# EAGLE design MetaSenseV02.3 (EAGLE 7.5.0)
MetaSense AQI Sensing Platform (v2)
DESIGNER: Christine Chan
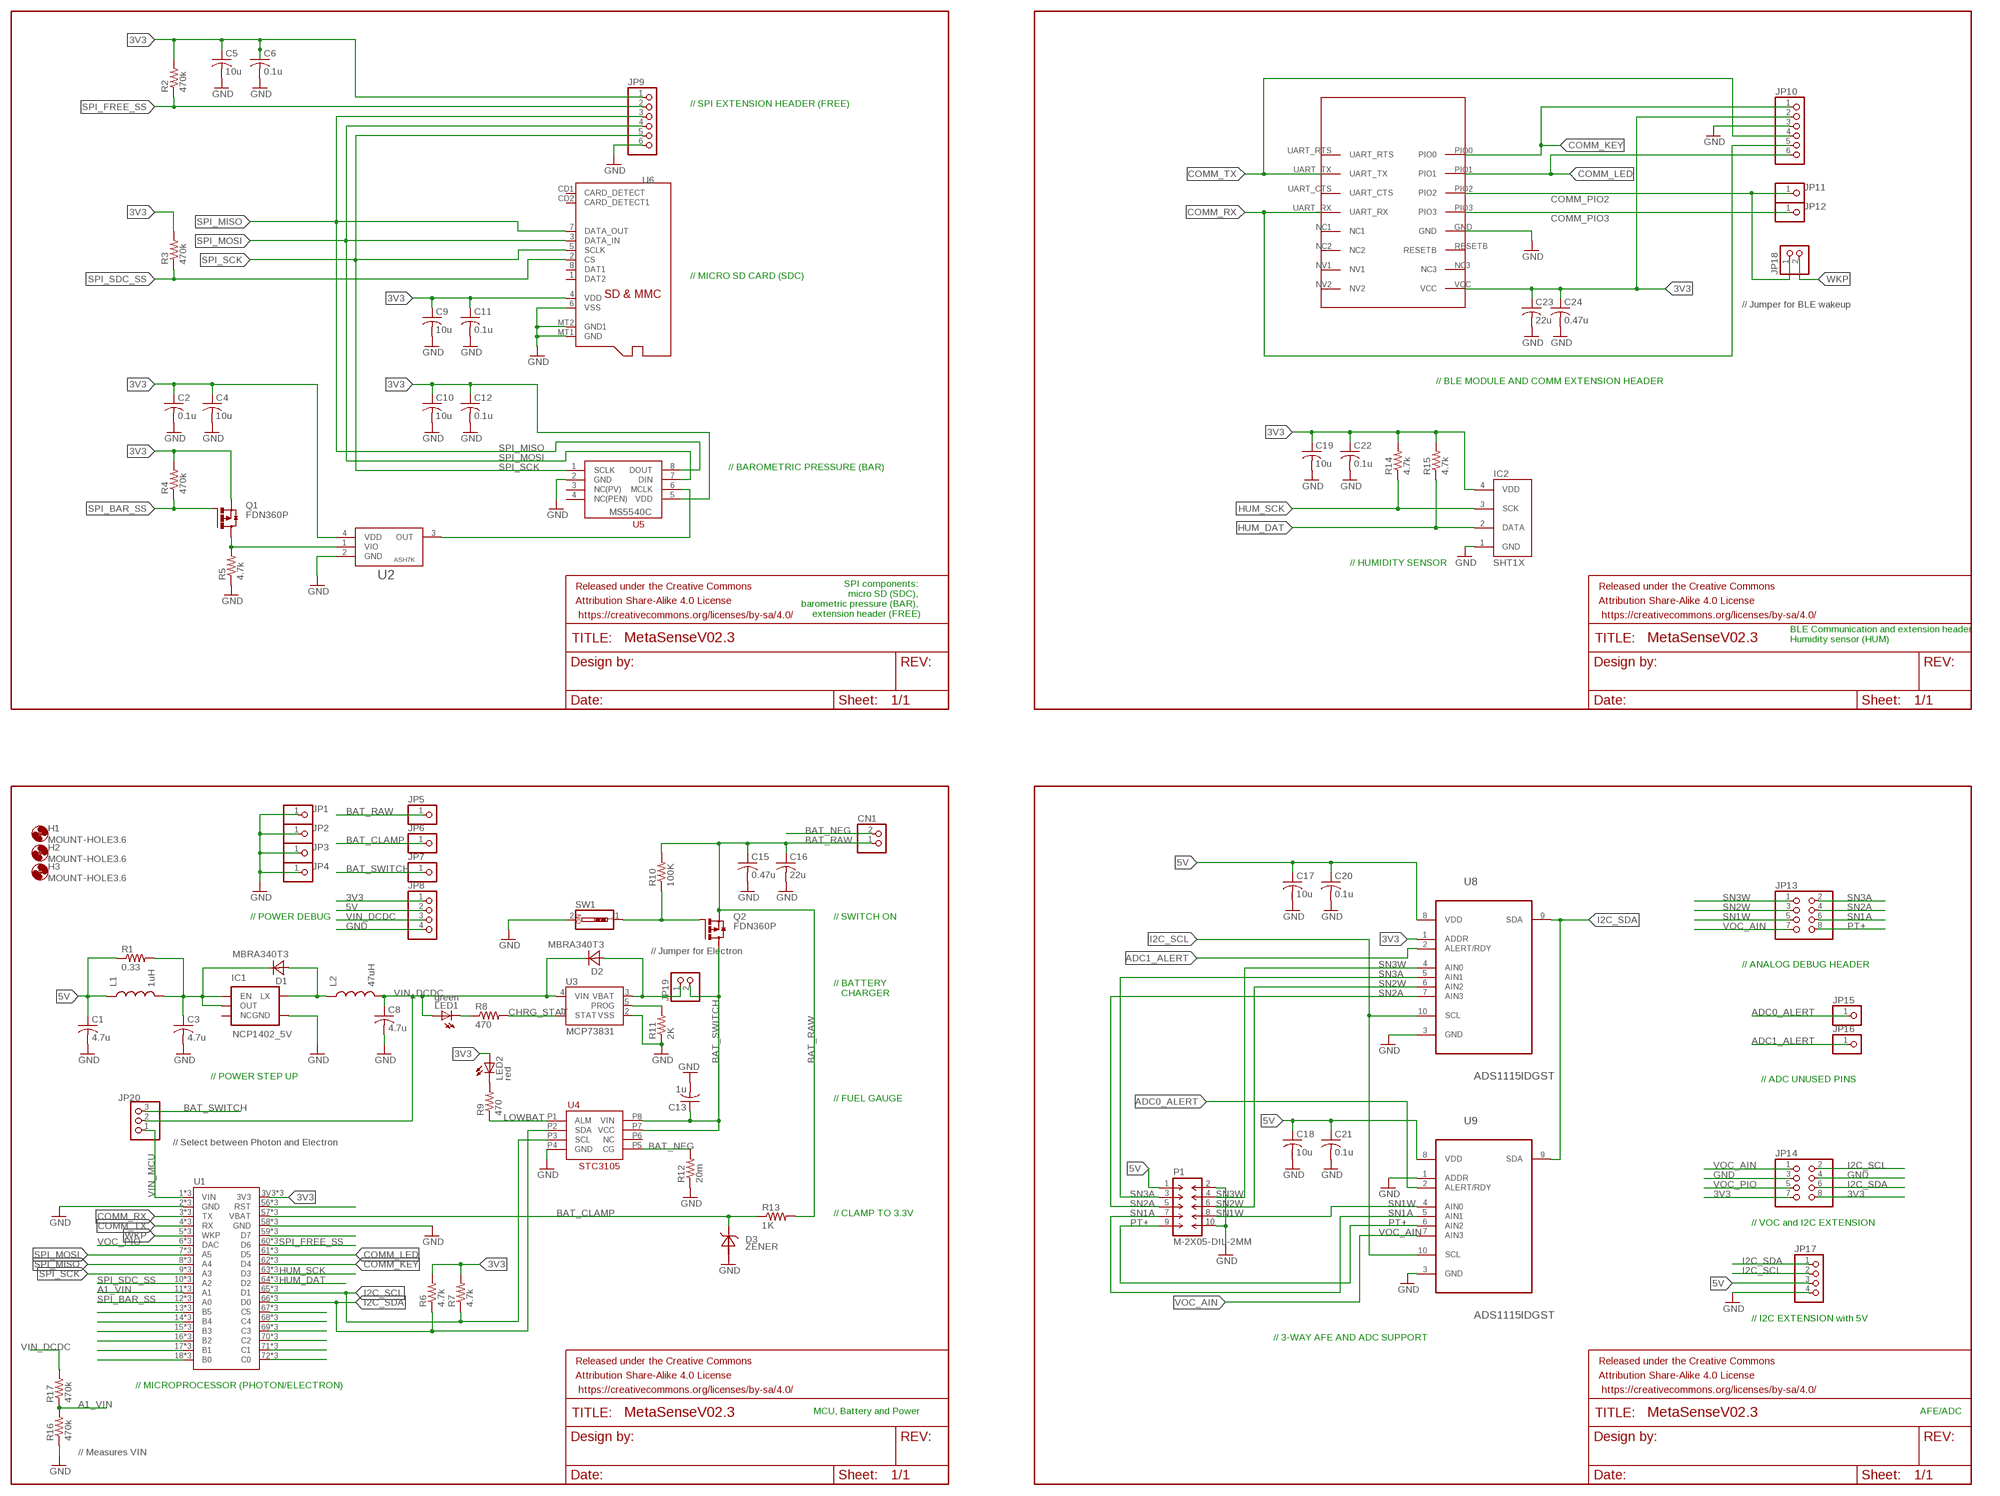
[diagram p0: schematic, sheet 1]

## Parts
C1  4.7u  C-USC0805  [C0805]
C2  0.1u  C-USC0805  [C0805]
C3  4.7u  C-USC0805  [C0805]
C4  10u  C-USC0805  [C0805]
C5  10u  C-USC0805  [C0805]
C6  0.1u  C-USC0805  [C0805]
C8  4.7u  C-USC0805  [C0805]
C9  10u  C-USC0805  [C0805]
C10  10u  C-USC0805  [C0805]
C11  0.1u  C-USC0805  [C0805]
C12  0.1u  C-USC0805  [C0805]
C13  1u  C-USC0805  [C0805]
C15  0.47u  C-USC0805  [C0805]
C16  22u  C-USC0805  [C0805]
C17  10u  C-USC0805  [C0805]
C18  10u  C-USC0805  [C0805]
C19  10u  C-USC0805  [C0805]
C20  0.1u  C-USC0805  [C0805]
C21  0.1u  C-USC0805  [C0805]
C22  0.1u  C-USC0805  [C0805]
C23  22u  C-USC0805  [C0805]
C24  0.47u  C-USC0805  [C0805]
CN1  JST_2PIN-THM  [JST-PH-2-THM]
D1  MBRA340T3  [SMA]
D2  MBRA340T3  [SMA]
D3  ZENER  [SOD-123_MINI-SMA]
FRAME1  FRAME-LETTERNO_PACKAGE  [DUMMY]
FRAME2  FRAME-LETTERNO_PACKAGE  [DUMMY]
FRAME3  FRAME-LETTERNO_PACKAGE  [DUMMY]
FRAME4  FRAME-LETTERNO_PACKAGE  [DUMMY]
H1  MOUNT-HOLE3.6  [3,6]
H2  MOUNT-HOLE3.6  [3,6]
H3  MOUNT-HOLE3.6  [3,6]
IC1  NCP1402_5V  V_REG_NCP1400_5V  [SOT23-5]
IC2  SHT1X  [SHT1X]
JP1  PINHD-1X1  [1X01]
JP2  PINHD-1X1  [1X01]
JP3  PINHD-1X1  [1X01]
JP4  PINHD-1X1  [1X01]
JP5  PINHD-1X1  [1X01]
JP6  PINHD-1X1  [1X01]
JP7  PINHD-1X1  [1X01]
JP8  PINHD-1X4  [1X04]
JP9  PINHD-1X6  [1X06]
JP10  PINHD-1X6  [1X06]
JP11  PINHD-1X1  [1X01]
JP12  PINHD-1X1  [1X01]
JP13  PINHD-2X4  [2X04]
JP14  PINHD-2X4  [2X04]
JP15  PINHD-1X1  [1X01]
JP16  PINHD-1X1  [1X01]
JP17  PINHD-1X4  [1X04]
JP18  PINHD-1X2  [1X02]
JP19  PINHD-1X2  [1X02]
JP20  PINHD-1X3  [1X03]
L1  1uH  INDUCTOR0805  [0805]
L2  47uH  INDUCTOR0805  [0805]
LED1  green  LEDCHIPLED_0805  [CHIPLED_0805]
LED2  red  LEDCHIPLED_0805  [CHIPLED_0805]
P1  M-2X05-DIL-2MM  [DIL-2MM-2X05]
Q1  FDN360P  [SUPER-SOT3]
Q2  FDN360P  [SUPER-SOT3]
R1  0.33  R-US_R0805  [R0805]
R2  470k  R-US_R0805  [R0805]
R3  470k  R-US_R0805  [R0805]
R4  470k  R-US_R0805  [R0805]
R5  4.7k  R-US_R0805  [R0805]
R6  4.7k  R-US_R0805  [R0805]
R7  4.7k  R-US_R0805  [R0805]
R8  470  R-US_R0805  [R0805]
R9  470  R-US_R0805  [R0805]
R10  100K  R-US_R0805  [R0805]
R11  2K  R-US_R0805  [R0805]
R12  20m  R-US_R0805  [R0805]
R13  1K  R-US_R0805  [R0805]
R14  4.7k  R-US_R0805  [R0805]
R15  4.7k  R-US_R0805  [R0805]
R16  470k  R-US_R0805  [R0805]
R17  470k  R-US_R0805  [R0805]
SW1  SW_DIP-1  [EDG-01]
U1  ELECTRONDUALROW  [ELECTRON_DUAL-ROW]
U2  ASH7K-OSCILLATOR  [SMD-4PAD]
U3  MCP73831  [SOT23-5]
U4  STC3105  [TDFN-8-3X2MM]
U5  MS5540CSMD  [SMD-HYBRID]
U6  MICROSD  [MICROSD]
U7  HM-11  [HM-11]
U8  ADS1115IDGST  [SOP50P490X110-10N]
U9  ADS1115IDGST  [SOP50P490X110-10N]

## Nets
3V3: C2.1 C4.1 C5.1 C6.1 C9.1 C10.1 C11.1 C12.1 C19.1 C22.1 C23.1 C24.1 IC2.4(VDD) JP8.1 JP9.1 JP10.2 JP14.7 JP14.8 LED2.A Q1.2(S) R2.2 R3.2 R4.2 R6.2 R7.2 R14.2 R15.2 U1.3V3 U1.55(3V3) U1.91(3V3) U2.4(VDD) U5.5(VDD) U6.4(VDD) U7.VCC U8.1(ADDR)
5V: C1.1 C17.1 C18.1 C20.1 C21.1 JP8.2 JP17.3 L1.1 P1.1 R1.1 U8.8(VDD) U9.8(VDD)
A1_VIN: R16.2 R17.1 U1.11(A1) U1.47(A1) U1.A1
ADC0_ALERT: JP15.1 U9.2(ALERT/RDY)
ADC1_ALERT: JP16.1 U8.2(ALERT/RDY)
BAT_CLAMP: D3.C(CAT) JP6.1 R13.1 U1.57(VBAT) U1.93(VBAT) U1.VBAT
BAT_NEG: CN1.2 R12.2 U4.P5(CG)
BAT_RAW: C15.1 C16.1 CN1.1 JP5.1 Q2.2(S) R10.2 R13.2
BAT_SWITCH: C13.1 JP7.1 JP19.2 JP20.3 Q2.3(D) U4.P7(VCC) U4.P8(VIN)
CHRG_STAT: R8.2 U3.1(STAT)
COMM_KEY: JP10.1 U1.62(D4) U1.98(D4) U1.D4 U7.PIO0
COMM_LED: JP10.6 U1.61(D5) U1.97(D5) U1.D5 U7.PIO1
COMM_PIO2: JP11.1 JP18.1 U7.PIO2
COMM_PIO3: JP12.1 U7.PIO3
COMM_RX: JP10.5 U1.3(TX) U1.39(TX) U1.TX U7.UART_RX
COMM_TX: JP10.4 U1.4(RX) U1.40(RX) U1.RX U7.UART_TX
GND: C1.2 C2.2 C3.2 C4.2 C5.2 C6.2 C8.2 C9.2 C10.2 C11.2 C12.2 C13.2 C15.2 C16.2 C17.2 C18.2 C19.2 C20.2 C21.2 C22.2 C23.2 C24.2 D3.A(AN) IC1.4(GND) IC2.1(GND) JP1.1 JP2.1 JP3.1 JP4.1 JP8.4 JP9.6 JP10.3 JP14.3 JP14.4 JP17.4 P1.2 P1.10 R5.1 R11.1 R12.1 R16.1 SW1.2 U1.2(GND) U1.38(GND) U1.58(GND) U1.94(GND) U1.GND U1.GND@2(GND) U2.2(GND) U3.2(VSS) U4.P4(GND) U5.2(GND) U6.6(VSS) U6.MT1(GND) U6.MT2(GND1) U7.GND U8.3(GND) U9.1(ADDR) U9.3(GND)
HUM_DAT: IC2.2(DATA) R15.1 U1.64(D2) U1.100(D2) U1.D2
HUM_SCK: IC2.3(SCK) R14.1 U1.63(D3) U1.99(D3) U1.D3
I2C_SCL: JP14.2 JP17.2 R7.1 U1.65(D1) U1.101(D1) U1.D1 U4.P3(SCL) U8.10(SCL) U9.10(SCL)
I2C_SDA: JP14.6 JP17.1 R6.1 U1.66(D0) U1.102(D0) U1.D0 U4.P2(SDA) U8.9(SDA) U9.9(SDA)
LOWBAT: R9.1 U4.P1(ALM)
N$1: Q1.3(D) R5.2 U2.1(VIO)
N$2: C3.1 D1.C IC1.1(EN) IC1.2(OUT) L1.2 R1.2
N$3: LED2.C R9.2
N$5: D1.A IC1.5(LX) L2.1
N$7: U1.56(RST) U1.92(RST) U1.RST
N$8: U1.67(C5) U1.103(C5) U1.C5
N$9: R11.2 U3.5(PROG)
N$11: LED1.C R8.1
N$12: Q2.1(G) R10.1 SW1.1
N$15: U1.68(C4) U1.104(C4) U1.C4
N$16: U2.3(OUT) U5.6(MCLK)
N$20: U1.69(C3) U1.105(C3) U1.C3
N$22: U1.70(C2) U1.106(C2) U1.C2
N$23: U1.71(C1) U1.107(C1) U1.C1
N$24: U1.72(C0) U1.108(C0) U1.C0
N$26: U1.13(B5) U1.49(B5) U1.B5
N$27: U1.59(D7) U1.95(D7) U1.D7
N$28: U1.14(B4) U1.50(B4) U1.B4
N$29: U1.15(B3) U1.51(B3) U1.B3
N$30: U1.16(B2) U1.52(B2) U1.B2
N$31: U1.17(B1) U1.53(B1) U1.B1
N$32: U1.18(B0) U1.54(B0) U1.B0
N$33: D2.A JP19.1 U3.3(VBAT)
PT+: JP13.8 P1.9 U9.6(AIN2)
SN1A: JP13.6 P1.7 U9.5(AIN1)
SN1W: JP13.5 P1.8 U9.4(AIN0)
SN2A: JP13.4 P1.5 U8.7(AIN3)
SN2W: JP13.3 P1.6 U8.6(AIN2)
SN3A: JP13.2 P1.3 U8.5(AIN1)
SN3W: JP13.1 P1.4 U8.4(AIN0)
SPI_BAR_SS: Q1.1(G) R4.1 U1.12(A0) U1.48(A0) U1.A0
SPI_FREE_SS: JP9.2 R2.1 U1.60(D6) U1.96(D6) U1.D6
SPI_MISO: JP9.3 U1.8(A4) U1.44(A4) U1.A4 U5.8(DOUT) U6.7(DATA_OUT)
SPI_MOSI: JP9.4 U1.7(A5) U1.43(A5) U1.A5 U5.7(DIN) U6.3(DATA_IN)
SPI_SCK: JP9.5 U1.9(A3) U1.45(A3) U1.A3 U5.1(SCLK) U6.5(SCLK)
SPI_SDC_SS: R3.1 U1.10(A2) U1.46(A2) U1.A2 U6.2(CS)
VIN_DCDC: C8.1 D2.C JP8.3 JP20.2 L2.2 LED1.A R17.2 U3.4(VIN)
VIN_MCU: JP20.1 U1.1(VIN) U1.37(VIN) U1.VIN
VOC_AIN: JP13.7 JP14.1 U9.7(AIN3)
VOC_PIO: JP14.5 U1.6(DAC) U1.42(DAC) U1.DAC
WKP: JP18.2 U1.5(WKP) U1.41(WKP) U1.WKP
Unconnected: IC1.3(NC) U4.P6(NC) U5.3(NC(PV)) U5.4(NC(PEN)) U6.1(DAT2) U6.8(DAT1) U6.CD1(CARD_DETECT) U6.CD2(CARD_DETECT1) U7.NC1 U7.NC2 U7.NC3 U7.NV1 U7.NV2 U7.RESETB U7.UART_CTS U7.UART_RTS

## Notes on the sheet
- // SPI EXTENSION HEADER (FREE)
- // MICRO SD CARD (SDC)
- // Jumper for BLE wakeup
- // BLE MODULE AND COMM EXTENSION HEADER
- // BAROMETRIC PRESSURE (BAR)
- // HUMIDITY SENSOR
- SPI components: 
  micro SD (SDC), 
  barometric pressure (BAR), 
  extension header (FREE)
- BLE Communication and extension header
  Humidity sensor (HUM)
- // POWER DEBUG | // SWITCH ON
- // Jumper for Electron
- // ANALOG DEBUG HEADER
- // BATTERY 
     CHARGER
- // POWER STEP UP
- // ADC UNUSED PINS
- // FUEL GAUGE
- // Select between Photon and Electron
- // CLAMP TO 3.3V
- // VOC and I2C EXTENSION
- // I2C EXTENSION with 5V
- // 3-WAY AFE AND ADC SUPPORT
- // MICROPROCESSOR (PHOTON/ELECTRON)
- MCU, Battery and Power | AFE/ADC
- // Measures VIN

## Library data of the parts
C1 C3 C8 = adafruit:C-US: CAPACITOR, American symbol; MF: VISHAY/DALE; MPN: IHLP2525CZER4R7M01; OC_NEWARK: 53K4859
C2 C6 C11 C12 C20-C22 = adafruit:C-US: CAPACITOR, American symbol; MF: KEMET; MPN: C0603C102J5GACTU; OC_NEWARK: 02J8136
C4 C5 C9 C10 C17-C19 = adafruit:C-US: CAPACITOR, American symbol; MPN: C0805C106Z8VACTU; OC_NEWARK: 76Y2954
C13 C15 C24 = adafruit:C-US: CAPACITOR, American symbol; MF: KEMET; MPN: C0402C471K5RACTU; OC_NEWARK: 88C9981
C16 C23 = adafruit:C-US: CAPACITOR, American symbol; OC_NEWARK: unknown
CN1 = adafruit:JST_2PIN: JST 2-Pin Connectors of various flavors SMT-RA (S2B-PH-SM4) 4UConnector #17311 SMT (B2B-PH-SM4) THM-RA (S2B-PH) THM (B2B-PH); OC_NEWARK: unknown
D1 D2 = diode:MBRA340T3: Surface Mount Schottky Power Rectifier Source: http://www.onsemi.com/pub_link/Collateral/MBRA340T3-D.PDF; OC_NEWARK: unknown
D3 = metasense:ZENER: Generic Zener Diode SOD-123 or Mini-SMA; OC_NEWARK: unknown
FRAME1-FRAME4 = SparkFun-Aesthetics:FRAME-LETTER: Schematic Frame Standard 8.5x11 US Letter frame; DESIGNER: Christine Chan; OC_NEWARK: unknown; VERSION: v02
H1-H3 = holes:MOUNT-HOLE: MOUNTING HOLE with drill center marker; OC_NEWARK: unknown
IC1 = SparkFun-PowerIC:V_REG_NCP1400: Switching step-up voltage regulator NCP1400 switiching regulator takes single cell AA and outputs 100mA at 3.3V or 5V with minimal number of external components.; MF: ON SEMICONDUCTOR; MPN: NCP1402SN50T1G; OC_NEWARK: 98H0882; PROD_ID: IC-10787; VALUE: 5.0v
IC2 = sht10_11_15:SHT1X; MF: SENSIRION AG; MPN: SHT11; OC_NEWARK: 69C4848
JP1-JP7 JP11 JP12 = pinhead:PINHD-1X1: PIN HEADER; OC_NEWARK: unknown
JP8 JP17 = pinhead:PINHD-1X4: PIN HEADER; OC_NEWARK: unknown
JP9 JP10 = adafruit:PINHD-1X6: PIN HEADER; OC_NEWARK: unknown
JP13 JP14 = adafruit:PINHD-2X4: PIN HEADER; OC_NEWARK: unknown
JP15 JP16 = adafruit:PINHD-1X1: Pin header 1x1 for 0.1" spacing With round pins; OC_NEWARK: unknown
JP18 JP19 = pinhead:PINHD-1X2: PIN HEADER
JP20 = pinhead:PINHD-1X3: PIN HEADER
L1 = SparkFun-Passives:INDUCTOR: Inductors Basic Inductor/Choke - 0603 and 1206. Footprints are not proven and vary greatly between part numbers. INDUCTOR POWER 3.3UH 4.0A SMD 0.197" L x 0.197" W x 0.177" H (5.00mm x 5.00mm x 4.50mm); MPN: LQM21NN1R0K10D; OC_NEWARK: 97K3787
L2 = SparkFun-Passives:INDUCTOR: Inductors Basic Inductor/Choke - 0603 and 1206. Footprints are not proven and vary greatly between part numbers. INDUCTOR POWER 3.3UH 4.0A SMD 0.197" L x 0.197" W x 0.177" H (5.00mm x 5.00mm x 4.50mm); OC_NEWARK: unknown
LED1 = adafruit:LED: LED OSRAM: - CHIPLED LG R971, LG N971, LY N971, LG Q971, LY Q971, LO R971, LY R971 LH N974, LH R974 LS Q976, LO Q976, LY Q976 LO Q996 - Hyper CHIPLED LW Q18S LB Q993, LB Q99A, LB R99A - SideLED LS A670, LO A670, LY A670, LG A670, LP A670 LB A673, LV A673, LT A673, LW A673 LH A674 LY A675 LS A676, LA A676, LO A676, LY A676, LW A676 LS A679, LY A679, LG A679 - Hyper Micro SIDELED® LS Y876, LA Y876, LO Y876, LY Y876 LT Y87S - SmartLED LW L88C, LW L88S LB L89C, LB L89S, LG L890 LS L89K, LO L89K, LY L89K LS L896, LA L896, LO L896, LY L896 - TOPLED LS T670, LO T670, LY T670, LG T670, LP T670 LSG T670, LSP T670, LSY T670, LOP T670, LYG T670 LG T671, LOG T671, LSG T671 LB T673, LV T673, LT T673, LW T673 LH T674 LS T676, LA T676, LO T676, LY T676, LB T676, LH T676, LSB T676, LW T676 LB T67C, LV T67C, LT T67C, LS T67K, LO T67K, LY T67K, LW E67C LS E67B, LA E67B, LO E67B, LY E67B, LB E67C, LV E67C, LT E67C LW T67C LS T679, LY T679, LG T679 LS T770, LO T770, LY T770, LG T770, LP T770 LB T773, LV T773, LT T773, LW T773 LH T774 LS E675, LA E675, LY E675, LS T675 LS T776, LA T776, LO T776, LY T776, LB T776 LHGB T686 LT T68C, LB T68C - Hyper Mini TOPLED® LB M676 - Mini TOPLED Santana® LG M470 LS M47K, LO M47K, LY M47K Source: http://www.osram.convergy.de/; MPN: NTE30003; OC_NEWARK: 32M3086
LED2 = adafruit:LED: LED OSRAM: - CHIPLED LG R971, LG N971, LY N971, LG Q971, LY Q971, LO R971, LY R971 LH N974, LH R974 LS Q976, LO Q976, LY Q976 LO Q996 - Hyper CHIPLED LW Q18S LB Q993, LB Q99A, LB R99A - SideLED LS A670, LO A670, LY A670, LG A670, LP A670 LB A673, LV A673, LT A673, LW A673 LH A674 LY A675 LS A676, LA A676, LO A676, LY A676, LW A676 LS A679, LY A679, LG A679 - Hyper Micro SIDELED® LS Y876, LA Y876, LO Y876, LY Y876 LT Y87S - SmartLED LW L88C, LW L88S LB L89C, LB L89S, LG L890 LS L89K, LO L89K, LY L89K LS L896, LA L896, LO L896, LY L896 - TOPLED LS T670, LO T670, LY T670, LG T670, LP T670 LSG T670, LSP T670, LSY T670, LOP T670, LYG T670 LG T671, LOG T671, LSG T671 LB T673, LV T673, LT T673, LW T673 LH T674 LS T676, LA T676, LO T676, LY T676, LB T676, LH T676, LSB T676, LW T676 LB T67C, LV T67C, LT T67C, LS T67K, LO T67K, LY T67K, LW E67C LS E67B, LA E67B, LO E67B, LY E67B, LB E67C, LV E67C, LT E67C LW T67C LS T679, LY T679, LG T679 LS T770, LO T770, LY T770, LG T770, LP T770 LB T773, LV T773, LT T773, LW T773 LH T774 LS E675, LA E675, LY E675, LS T675 LS T776, LA T776, LO T776, LY T776, LB T776 LHGB T686 LT T68C, LB T68C - Hyper Mini TOPLED® LB M676 - Mini TOPLED Santana® LG M470 LS M47K, LO M47K, LY M47K Source: http://www.osram.convergy.de/; MPN: NTE30002; OC_NEWARK: 32M3085
P1 = con-headers-jp:M-2X05-: MALE HEADER; OC_NEWARK: unknown
Q1 Q2 = transistor-power:FDN360P: Single P-Channel, PowerTrench (R) MOSFET Source: http://www.fairchildsemi.com/ds/FD/FDN360P.pdf; MF: FAIRCHILD SEMICONDUCTOR; MPN: FDN360P; OC_NEWARK: 58K1466
R1 R8 R9 R11 R12 = adafruit:R-US_: RESISTOR, American symbol; OC_NEWARK: unknown
R2-R4 = adafruit:R-US_: RESISTOR, American symbol; MF: VISHAY/DALE; MPN: CRCW0805470KJNEA; OC_NEWARK: 28K0214
R5-R7 R14-R17 = adafruit:R-US_: RESISTOR, American symbol; MF: VISHAY/DALE; MPN: CRCW08054K70JNEA; OC_NEWARK: 01H7096
R10 = adafruit:R-US_: RESISTOR, American symbol; MPN: ERA-6AEB104V; OC_NEWARK: 08N2143
R13 = adafruit:R-US_: RESISTOR, American symbol; MPN: ERJ-6ENF1001V; OC_NEWARK: 64R5369
SW1 = special:SW_DIP-1: DIP SWITCH; OC_NEWARK: unknown
U1 = Particle:ELECTRON; OC_NEWARK: unknown
U2 = metasense:ASH7K-OSCILLATOR: ASHK7K Abracon Oscillator; OC_NEWARK: unknown
U3 = SparkFun-PowerIC:MCP73831: Miniature single cell, fully integrated Li-Ion, Li-polymer charge management controller http://ww1.microchip.com/downloads/en/DeviceDoc/20001984g.pdf IC-09995; MPN: MCP73831T-2DCI/OT; OC_NEWARK: 84R6271; PROD_ID: IC-09995
U4 = metasense:STC3105
U5 = metasense:MS5540C: MS5540C Miniature Barometric Module; OC_NEWARK: unknown
U6 = metasense:MICROSD: Micro-SD / Transflash card holder with SPI pinout For the 3M # 2908-05WB-MG and/or 4UCON #19656 push-push type; MPN: 2908-05WB-MG; OC_NEWARK: 28M0115
U7 = HM-11:HM-11; OC_NEWARK: unknown
U8 U9 = Texas Instruments_By_element14_Batch_1:ADS1115IDGST: Analog-to-Digital Converter with Internal Reference; MPN: ADS1115IDGST; OC_FARNELL: 1762981; OC_NEWARK: 25R1241; PACKAGE: MSOP-10; SUPPLIER: Texas Instruments

## Board
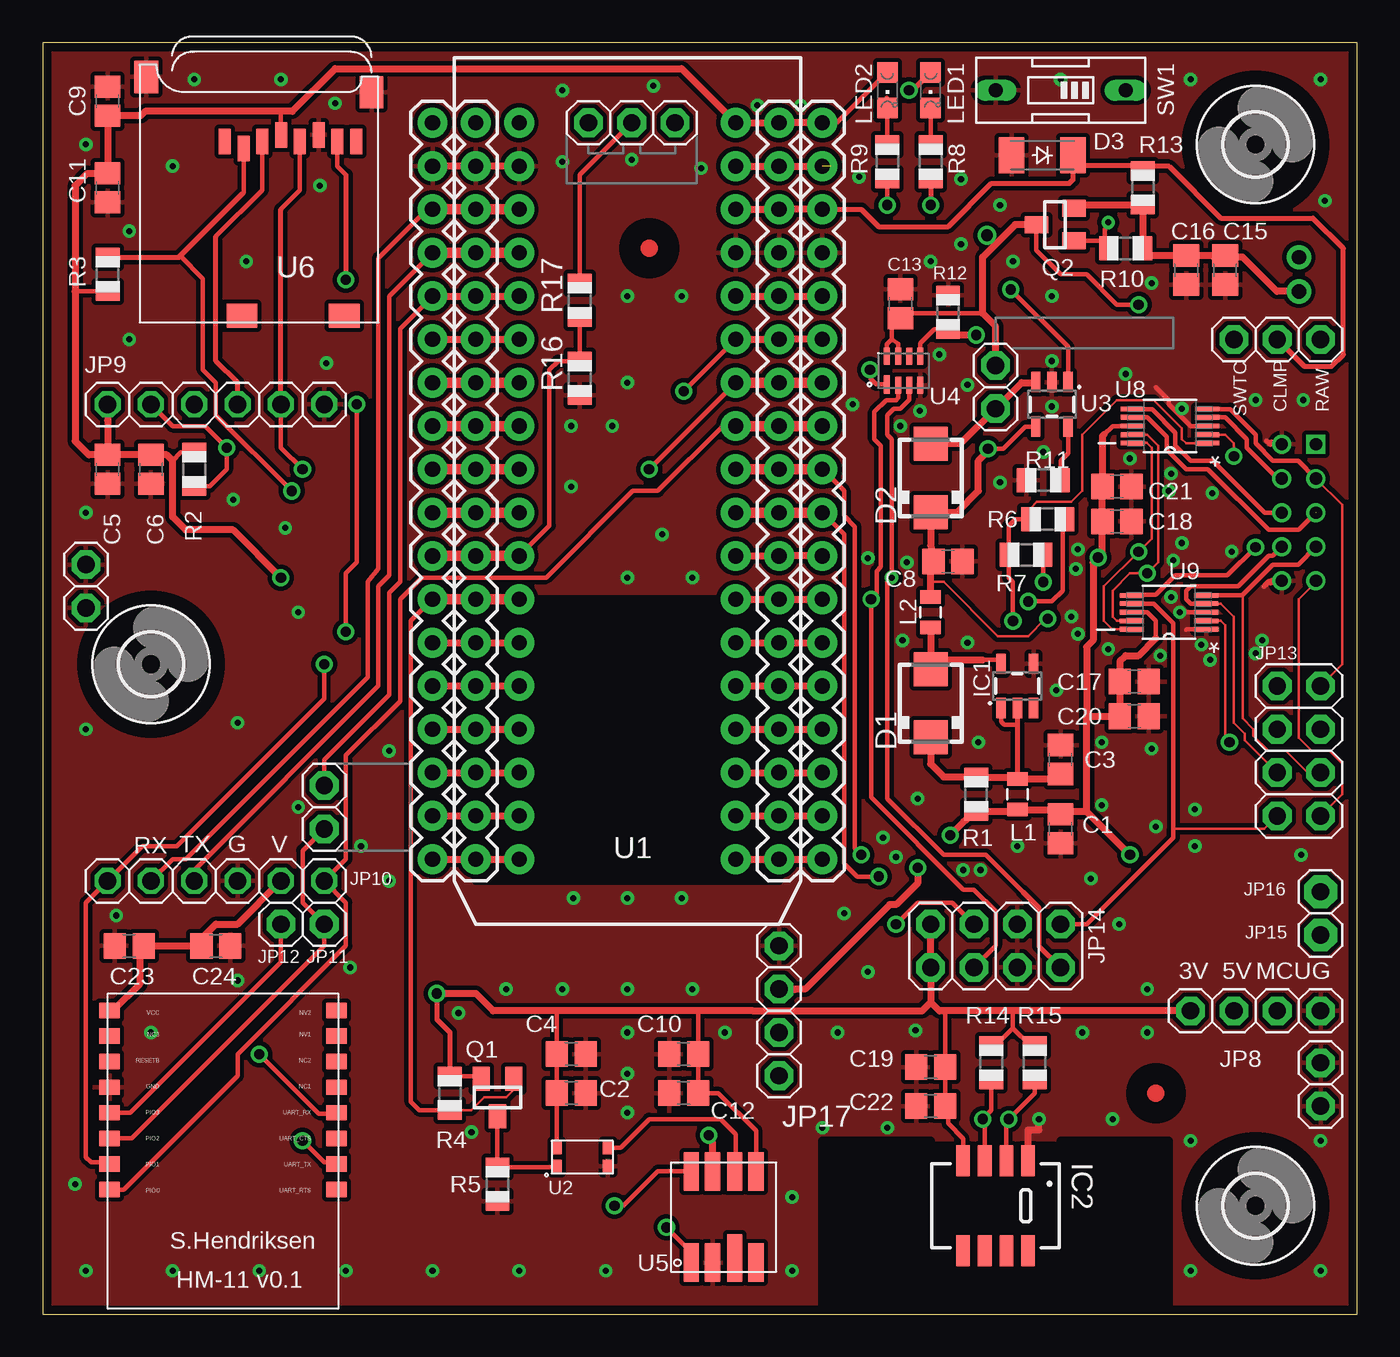
[diagram p1: board, top side]
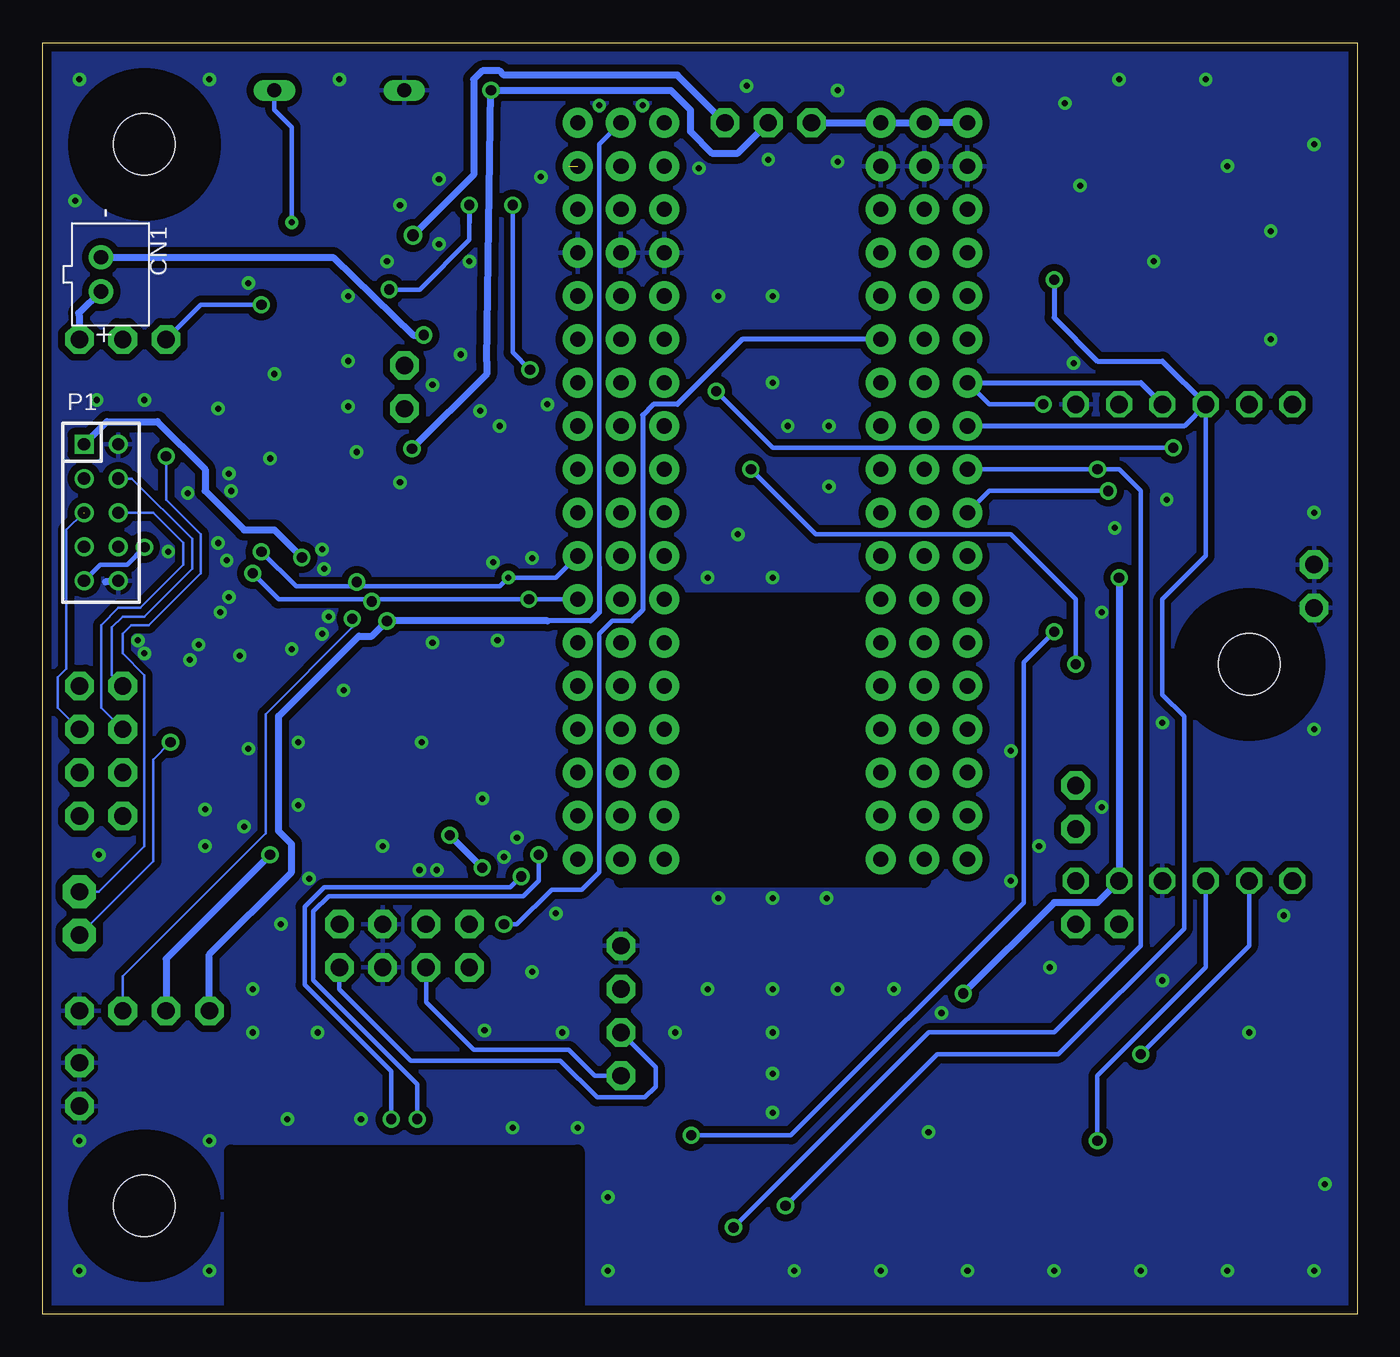
[diagram p2: board, bottom side, seen from below]

Size 77.09 x 74.55 mm. Coordinates in mm from the lower left corner, seen from the top.
Outline: 0,0 77.09,0 77.09,74.55 0,74.55 0,0
Copper layers (1*16): Top 0.0178mm / dielectric 59mil / Bottom 0.0178mm
Design rules "SSC-EAGLE-2Lyr_v1.0.0.3 *": minimum track width 6mil, minimum drill 14mil, track to track 6mil, track to pad 6mil, pad to pad 6mil, via to via 6mil, smd to smd 6mil, copper to edge 20mil, drill to drill 16mil, minimum pad ring 8mil, minimum via ring 8mil, stop-mask expansion 3mil, vias tented up to drill 15mil, thermal gap 10mil
tRestrict: area 25.4,25.4 to 43.2,41.9; area 45.7,-1.3 to 52.1,10.2; area 59.7,-1.3 to 66,10.2; area 45.7,-1.3 to 66,2.5; area 63.8,11.5 to 66.8,14.5; area 34.1,61 to 37.1,64
bRestrict: area 25.4,25.4 to 43.2,41.9; area 45.7,0.6 to 66,9.5

### Footprints (pad centres in the part's own frame; a part is rotated, then mirrored left to right if it is on the bottom)
C0805 = smd 1.3 x 1.5: 1 -0.85,0; 2 0.85,0
JST-PH-2-THM = drill 0.838 pad 1.422: 1 1,0; 2 -1,0
SMA = smd 2 x 2: A 2,0; C -2,0
SOD-123_MINI-SMA = smd 1.5 x 2.1: A 1.8,0; C -1.8,0
3,6 = hole 3.6: 0,0
SOT23-5 = smd 0.55 x 1.2: 1 -0.95,-1.3; 2 0,-1.3; 3 0.95,-1.3; 4 0.95,1.3; 5 -0.95,1.3
SHT1X = smd 1.803 x 0.8: 1 -2.642,1.905; 2 -2.642,0.635; 3 -2.642,-0.635; 4 -2.642,-1.905; 5 2.642,-1.905; 6 2.642,-0.635; 7 2.642,0.635; 8 2.642,1.905
1X01 = drill 1.016 pad 1.676 octagon: 1 0,0
1X04 = drill 1.016 pad 1.676 octagon: 1 -3.81,0; 2 -1.27,0; 3 1.27,0; 4 3.81,0
1X06 = drill 1.016 octagon: 1 -6.35,0; 2 -3.81,0; 3 -1.27,0; 4 1.27,0; 5 3.81,0; 6 6.35,0
2X04 = drill 1.016 pad 1.676 octagon: 1 -3.81,-1.27; 2 -3.81,1.27; 3 -1.27,-1.27; 4 -1.27,1.27; 5 1.27,-1.27; 6 1.27,1.27; 7 3.81,-1.27; 8 3.81,1.27
1X01' = drill 1.016 pad 1.93 octagon: 1 0,0
1X02 = drill 1.016 pad 1.676 octagon: 1 -1.27,0; 2 1.27,0
1X03 = drill 1.016 pad 1.676 octagon: 1 -2.54,0; 2 0,0; 3 2.54,0
0805 = smd 0.8 x 1.2: 1 -0.9,0; 2 0.9,0
CHIPLED_0805 = smd 1.2 x 1.2: A 0,-1.05; C 0,1.05
DIL-2MM-2X05 = drill 0.711 square: 1 -4,-1 | drill 0.711: 2 -4,1; 3 -2,-1; 4 -2,1; 5 0,-1; 6 0,1; 7 2,-1; 8 2,1; 9 4,-1; 10 4,1
SUPER-SOT3 = smd 1 x 1.4: 1 -0.95,-1.1; 2 0.95,-1.1; 3 0,1.1
R0805 = smd 1.1 x 1.4: 1 -1,0; 2 1,0
EDG-01 = drill 0.813 long: 1 0,-3.81; 2 0,3.81
ELECTRON_DUAL-ROW = drill 0.889 pad 1.753: 1 1.27,2.54; 2 3.81,2.54; 3 6.35,2.54; 3V3 1.27,22.86; 4 8.89,2.54; 5 11.43,2.54; 6 13.97,2.54; 7 16.51,2.54; 8 19.05,2.54; 9 21.59,2.54; 10 24.13,2.54; 11 26.67,2.54; 12 29.21,2.54; 13 31.75,2.54; 14 34.29,2.54; 15 36.83,2.54; 16 39.37,2.54; 17 41.91,2.54; 18 44.45,2.54; 37 1.27,7.62; 38 3.81,7.62; 39 6.35,7.62; 40 8.89,7.62; 41 11.43,7.62; 42 13.97,7.62; 43 16.51,7.62; 44 19.05,7.62; 45 21.59,7.62; 46 24.13,7.62; 47 26.67,7.62; 48 29.21,7.62; 49 31.75,7.62; 50 34.29,7.62; 51 36.83,7.62; 52 39.37,7.62; 53 41.91,7.62; 54 44.45,7.62; 55 1.27,20.32; 56 3.81,20.32; 57 6.35,20.32; 58 8.89,20.32; 59 11.43,20.32; 60 13.97,20.32; 61 16.51,20.32; 62 19.05,20.32; 63 21.59,20.32; 64 24.13,20.32; 65 26.67,20.32; 66 29.21,20.32; 67 31.75,20.32; 68 34.29,20.32; 69 36.83,20.32; 70 39.37,20.32; 71 41.91,20.32; 72 44.45,20.32; 91 1.27,25.4; 92 3.81,25.4; 93 6.35,25.4; 94 8.89,25.4; 95 11.43,25.4; 96 13.97,25.4; 97 16.51,25.4; 98 19.05,25.4; 99 21.59,25.4; 100 24.13,25.4; 101 26.67,25.4; 102 29.21,25.4; 103 31.75,25.4; 104 34.29,25.4; 105 36.83,25.4; 106 39.37,25.4; 107 41.91,25.4; 108 44.45,25.4; A0 29.21,5.08; A1 26.67,5.08; A2 24.13,5.08; A3 21.59,5.08; A4 19.05,5.08; A5 16.51,5.08; B0 44.45,5.08; B1 41.91,5.08; B2 39.37,5.08; B3 36.83,5.08; B4 34.29,5.08; B5 31.75,5.08; C0 44.45,22.86; C1 41.91,22.86; C2 39.37,22.86; C3 36.83,22.86; C4 34.29,22.86; C5 31.75,22.86; D0 29.21,22.86; D1 26.67,22.86; D2 24.13,22.86; D3 21.59,22.86; D4 19.05,22.86; D5 16.51,22.86; D6 13.97,22.86; D7 11.43,22.86; DAC 13.97,5.08; GND 8.89,22.86; GND@2 3.81,5.08; RST 3.81,22.86; RX 8.89,5.08; TX 6.35,5.08; VBAT 6.35,22.86; VIN 1.27,5.08; WKP 11.43,5.08
SMD-4PAD = smd 0.6 x 0.8: 1 0.3,0.4; 2 3.3,0.4; 3 3.3,1.5; 4 0.3,1.5
TDFN-8-3X2MM = smd 0.35 x 1.1: P1 -0.975,-0.8 | smd 0.35 x 1: P2 -0.325,-0.85; P3 0.325,-0.85; P4 0.975,-0.85; P5 0.975,0.85; P6 0.325,0.85; P7 -0.325,0.85; P8 -0.975,0.85
SMD-HYBRID = smd 2.25 x 0.9: 1 5.875,1.2; 2 5.875,2.45; 4 5.875,5; 5 0.525,5; 6 0.525,3.75; 7 0.525,2.45; 8 0.525,1.2 | smd 2.8 x 0.9: 3 5.6,3.75
MICROSD = smd 0.7 x 1.5: 1 9,-10.64; 2 7.9,-10.24; 3 6.8,-10.64; 4 5.7,-11.04; 5 4.6,-10.64; 6 3.5,-11.04; 7 2.4,-10.64; 8 1.3,-10.64 | smd 1.8 x 1.4: CD1 2,-0.44; CD2 8,-0.44 | smd 1.4 x 1.9: MT1 0.4,-13.54; MT2 13.6,-14.44
HM-11 = smd 1.2 x 0.9: GND 7.508,-0.6; NC1 -5.808,-0.6; NC2 -5.808,-2.1; NC3 7.508,-3.6; NV1 -5.808,-3.6; NV2 -5.808,-5.1; PIO0 7.508,5.4; PIO1 7.508,3.9; PIO2 7.508,2.4; PIO3 7.508,0.9; RESETB 7.508,-2.1; UART_CTS -5.808,2.4; UART_RTS -5.808,5.4; UART_RX -5.808,0.9; UART_TX -5.808,3.9; VCC 7.508,-5.1
SOP50P490X110-10N = smd 1.422 x 0.279: 1 -2.184,0.991; 2 -2.184,0.508; 3 -2.184,0; 4 -2.184,-0.508; 5 -2.184,-0.991; 6 2.184,-0.991; 7 2.184,-0.508; 8 2.184,0; 9 2.184,0.508; 10 2.184,0.991

### Placement (x,y rotation side)
C1  59.69,28.45 270 top
C2  30.99,12.95 0 top
C3  59.69,32.51 90 top
C4  30.99,15.24 0 top
C5  3.81,49.53 270 top
C6  6.35,49.53 270 top
C8  53.09,44.13 0 top
C9  3.81,71.12 90 top
C10  37.59,15.24 180 top
C11  3.81,66.04 270 top
C12  37.59,12.95 180 top
C13  50.29,59.25 90 top
C15  69.34,61.21 270 top
C16  67.06,61.21 270 top
C17  64.01,37.08 0 top
C18  62.99,46.48 0 top
C19  52.07,14.48 180 top
C20  64.01,35.05 0 top
C21  62.99,48.51 0 top
C22  52.07,12.19 180 top
C23  5.08,21.59 180 top
C24  10.16,21.59 0 top
CN1  73.66,60.96 270 bottom
D1  52.07,35.81 90 top
D2  52.07,49.02 90 top
D3  58.61,67.94 180 top
FRAME1  0,-11.18 0 top  (outside the outline)
FRAME2  -1.02,-12.19 0 top  (outside the outline)
FRAME3  -2.03,-13.21 0 top  (outside the outline)
FRAME4  2.54,-10.16 0 top  (outside the outline)
H1  71.12,68.58 0 top
H2  71.12,6.35 0 top
H3  6.35,38.1 0 top
IC1  57.15,36.83 0 top
IC2  55.88,6.35 270 top
JP1  2.54,43.94 0 top
JP2  2.54,41.4 0 top
JP3  74.93,14.73 0 top
JP4  74.93,12.19 0 top
JP5  74.93,57.15 0 top
JP6  72.39,57.15 0 top
JP7  69.85,57.15 0 top
JP8  71.12,17.78 0 top
JP9  10.16,53.34 0 top
JP10  10.16,25.4 180 top
JP11  16.51,22.86 0 top
JP12  13.97,22.86 0 top
JP13  73.66,33.02 270 top
JP14  55.88,21.59 180 top
JP15  [1X01']  74.93,22.23 0 top
JP16  [1X01']  74.93,24.77 0 top
JP17  43.18,17.78 90 top
JP18  16.51,29.72 90 top
JP19  55.88,54.36 90 top
JP20  34.54,69.85 0 top
L1  57.15,30.48 90 top
L2  52.07,41.15 90 top
LED1  52.07,71.75 180 top
LED2  49.53,71.75 180 top
P1  73.66,46.99 270 bottom
Q1  26.67,12.7 180 top
Q2  59.37,63.88 90 top
R1  54.74,30.48 90 top
R2  8.89,49.53 90 top
R3  3.81,60.96 270 top
R4  23.88,12.95 90 top
R5  26.67,7.62 90 top
R6  58.93,46.61 180 top
R7  57.66,44.51 180 top
R8  52.07,67.56 270 top
R9  49.53,67.56 90 top
R10  63.5,62.48 0 top
R11  58.67,48.9 0 top
R12  53.09,58.74 270 top
R13  64.52,66.04 270 top
R14  55.63,14.73 90 top
R15  58.17,14.73 90 top
R16  31.5,54.86 90 top
R17  31.5,59.44 90 top
SW1  59.69,71.75 90 top
U1  20.32,71.12 270 top
U2  29.84,8.26 0 top
U3  59.18,53.34 180 top
U4  50.48,55.31 0 top
U5  36.83,8.89 270 top
U6  19.68,58.1 180 top
U7  11.43,12.7 180 top
U8  66.1,52.07 180 top
U9  66.04,41.15 180 top

### Tracks (layer width: path | path; a pad name or v marks a point on that pad's centre or on a via)
3V3  (via drill 0.6)
  Top 0.152: R6.2 57.93,47.26 58.29,47.62 60.33,47.62 60.96,48.26 60.96,51.56 62.99,53.59 65.15,53.59 66.8,51.94 66.8,51.31 67.06,51.05 68.26,51.05 U8.1
  Top 0.254: R3.2 1.92,59.96 arc90 1.91,59.94 | 8.74,50.38 R2.2 8.11,50.53 7.62,50.04 | 13.97,70.52 13.97,69.16 U6.4 | U1.91 46.58,69.85 LED2.A | R4.2 25.57,13.95 Q1.2 | U2.4 30.14,13.46 C2.1 C4.1 30.14,17.69 30.23,17.78 | IC2.4 53.98,10.29 53.09,11.18 53.09,12.19 C22.1 C19.1 52.92,17.69 52.83,17.78 | R14.2 55.86,15.73 56.9,16.76 | 56.9,16.76 56.9,17.78 | R15.2 57.93,15.73 56.9,16.76 | 41.74,17.69 41.66,17.78 | R7.2 56.64,43.77 | 56.64,43.77 56.64,46.23 57.02,46.61 R6.2 | U5.5 41.83,10.75 39.62,12.95 C12.1 C10.1 38.44,17.69 38.35,17.78 | v56.9,40.64 56.9,42.93 56.64,43.18 56.64,43.77
  Top 0.305: C11.1 3.39,66.89 | v23.11,18.8 23.11,17.27 23.88,16.51 R4.2
  Top 0.406: C5.1 JP9.1 3.81,52.39 | U1.91 U1.3V3 U1.55 37.47,73.03 17.14,73.03 14.64,70.52 13.97,70.52 6.01,70.52 5.75,70.27 C9.1 C11.1 2.63,66.89 1.91,66.17 1.91,59.94 1.91,51.18 2.71,50.38 C5.1 | U7.VCC 4.15,17.8 5.71,19.37 5.71,21.38 C23.1 C24.1 9.31,22.01 10.16,22.86 11.43,22.86 JP10.2 | v13.97,43.18 11.18,45.97 8.38,45.97 7.62,46.74 7.62,50.04 7.28,50.38 C6.1 C5.1 | JP8.1 56.9,17.78 52.83,17.78 52.58,17.78 52.07,18.29 | v23.11,18.8 25.4,18.8 26.42,17.78 30.23,17.78 38.35,17.78 41.66,17.78 51.56,17.78 52.07,18.29 | JP14.7 JP14.8 52.07,18.29
  Bottom 0.254: 44.45,43.81 44.45,68.58 U1.3V3
  Bottom 0.305: 44.45,43.81 44.45,41.15 44.96,40.64 47.5,40.64
  Bottom 0.406: JP10.2 15.24,24.13 17.78,24.13 v23.11,18.8 | v13.97,43.18 13.97,25.72 14.29,25.4 | JP8.1 67.31,21.08 62.48,25.91 62.48,27.56 63.25,28.32 63.25,35.05 58.55,39.75 57.78,39.75 v56.9,40.64 47.5,40.64
5V  (via drill 0.6)
  Top 0.254: U8.8 62.74,52.07 62.23,51.56 | U9.8 64.77,41.15 65.28,40.64 65.28,39.62
  Top 0.305: 57.05,29.48 L1.1
  Top 0.406: 57.05,29.48 R1.1 53.98,28.83 v53.21,28.07 | L1.1 59.94,29.58 C1.1 60.11,29.46 61.21,29.46 | 61.21,29.46 61.21,35.05 | 61.21,35.05 C20.1 C17.1 63.16,38.27 63.5,38.61 64.26,38.61 65.28,39.62 | 62.23,51.56 62.14,51.47 C21.1 C18.1 62.14,44.62 v61.89,44.36 | 61.21,29.46 v63.75,26.92 | 44.2,19.05 JP17.3 44.7,19.05 49.66,24 50.04,24 51.31,25.27 v51.31,26.16 | v61.89,44.36 61.89,44.28 | v61.89,44.36 61.59,44.07 61.59,39.5 61.21,39.12 61.21,35.05
  Bottom 0.406: P1.1 73.33,52.32 70.36,52.32 67.56,49.53 67.56,48.26 65.28,45.97 63.5,45.97 v61.89,44.36 | v63.75,26.92 69.85,20.83 JP8.2 | v51.31,26.16 v53.21,28.07
A1_VIN
  Top 0.254: U1.47 29.72,46.23 29.72,55.37 30.23,55.88 31.23,55.88 R16.2 R17.1
  Top 0.61: U1.11 U1.A1 U1.47
ADC0_ALERT  (via drill 0.6)
  Top 0.152: U9.2 69.09,40.64 69.34,40.39 69.34,33.78 v69.6,33.53
  Bottom 0.152: JP15.1 70.61,26.54 70.61,32.51 v69.6,33.53
ADC1_ALERT  (via drill 0.6)
  Top 0.152: U8.2 69.34,51.56 69.85,51.05 v69.85,50.29
  Bottom 0.152: v69.85,50.29 69.85,47.75 67.82,45.72 67.82,43.43 70.87,40.39 71.88,40.39 72.39,39.88 72.39,38.73 71.12,37.47 71.12,27.43 73.79,24.77 JP16.1
BAT_CLAMP
  Top 0.305: JP6.1 73.98,55.56 75.56,55.56 76.26,56.26 76.26,62.48 74.49,64.26 69.09,64.26 66.06,67.29 64.77,67.29 R13.1 64.44,67.37 60.98,67.37 D3.C 60.41,66.51 60.2,66.29 55.63,66.29 53.09,63.75 49.02,63.75 48.01,64.77 U1.93
  Top 0.406: U1.57 U1.VBAT U1.93
BAT_NEG  (via drill 0.6)
  Top 0.254: U4.P5 51.46,56.92 52.28,57.74 R12.2
  Top 0.406: v54.74,57.4 53.21,57.4 R12.2
  Bottom 0.406: CN1.2 60.05,61.96 55.37,57.4 v54.74,57.4
BAT_RAW
  Top 0.406: CN1.1 72.37,59.96 70.36,61.98 68.67,61.98 C15.1 C16.1 64.59,62.06 R10.2 64.52,61.99 R13.2 | 64.31,64.83 R13.2 | Q2.2 60.68,65.04 R13.2
  Bottom 0.406: CN1.1 74.98,58.69 74.93,58.42 JP5.1
BAT_SWITCH  (via drill 0.6, 0.7)
  Top 0.254: U4.P8 49.51,56.87 49.78,57.15 | U4.P7 50.16,56.9 49.78,57.15 | 55.12,58.67 50.01,58.67 C13.1 49.78,57.89 49.78,57.15 | Q2.3 58.27,62.38 59.69,60.96 61.21,60.96 62.99,59.18 v64.26,59.18
  Top 0.406: Q2.3 57.02,63.88 55.88,62.74 | 55.88,62.74 55.12,61.98 55.12,58.67 55.88,57.91 JP19.2 | v55.37,63.25 55.88,62.74
  Bottom 0.254: v64.26,59.18 67.82,59.18 JP7.1
  Bottom 0.406: JP20.3 39.88,72.64 50.04,72.64 50.29,72.9 51.31,72.9 51.82,72.39 51.82,66.8 v55.37,63.25
CHRG_STAT  (via drill 0.6)
  Top 0.254: U3.1 60.13,56.71 v56.77,60.07
  Top 0.305: R8.2 v52.07,65.02
  Bottom 0.254: 52.07,64.01 52.07,62.99 54.99,60.07 v56.77,60.07
  Bottom 0.305: v52.07,65.02 52.07,64.01
COMM_KEY
  Top 0.254: U7.PIO0 4.76,7.3 11.43,13.97 11.43,15.24 17.78,21.59 17.78,24.13 JP10.1 17.78,26.67 17.78,32.77 20.95,35.94 20.95,41.91 22.23,43.18 29.53,43.18 34.61,48.26 36.07,48.26 39.88,52.07 U1.62
  Top 0.61: U1.62 U1.D4 U1.98
COMM_LED  (via drill 0.6)
  Top 0.254: v35.56,49.53 U1.61 | U7.PIO1 3.83,8.89 2.86,8.89 2.54,9.21 2.54,24.13 JP10.6 5.84,27.43 7.87,27.43 16.51,36.07 v16.51,38.1
  Top 0.61: U1.61 U1.D5 U1.97
  Bottom 0.254: v16.51,38.1 16.51,41.91 20.32,45.72 31.75,45.72 v35.56,49.53
COMM_PIO2
  Top 0.254: U7.PIO2 5.22,10.3 16.51,21.59 JP11.1 15.24,24.13 15.24,27.18 JP18.1
  Top 0.406: 4.06,10.16 U7.PIO2
COMM_PIO3
  Top 0.254: U7.PIO3 5.13,11.8 13.97,20.64 JP12.1
COMM_RX  (via drill 0.6)
  Top 0.254: v12.7,15.24 16.19,11.75 17.19,11.75 U7.UART_RX | U1.3 22.54,64.77 19.68,61.91 19.68,43.69 19.05,42.93 19.05,37.34 8.38,26.67 7.62,26.67 JP10.5
  Top 0.61: U1.39 U1.TX U1.3
  Bottom 0.254: JP10.5 6.35,21.59 v12.7,15.24
COMM_TX  (via drill 0.6)
  Top 0.254: v15.24,10.16 16.51,8.89 17.15,8.89 U7.UART_TX | U1.4 20.32,59.69 20.32,43.31 19.68,42.67 19.68,36.83 8.89,26.04 JP10.4
  Top 0.61: U1.4 U1.RX U1.40
  Bottom 0.254: JP10.4 8.89,20.32 15.24,13.97 v15.24,10.16
GND  (via drill 0.36 pad 0.79)
  Top 0.254: U9.3 67.06,41.15 | U9.1 67.08,40.16 67.06,40.13 | U8.3 67.31,52.07 66.04,53.34 66.04,53.59 65.28,54.36
  Top 0.305: 72.01,42.93 71.88,42.93 71.63,42.67 | 72.01,51.05 71.75,51.18
  Top 0.406: IC2.1 57.78,10.79 58.42,10.79 v58.42,11.43 | U1.38 U1.2 | 72.64,42.93 72.01,42.93 | 72.64,51.05 72.01,51.05
  Bottom 0.406: 72.64,42.93 73.41,42.93
  other vias: 52.07,61.72 56.13,65.02 56.9,61.72 53.85,66.55 47.5,53.34 51.44,52.96 50.29,52.07 52.58,56.26 54.23,54.48 59.18,53.21 56.13,48.77 66.17,42.04 62.48,38.99 63.75,50.16 65.02,60.45 59.18,59.69 63.5,55.12 58.67,50.55 60.71,44.83 68.58,48.13 66.29,44.2 48.39,44.32 50.67,44.07 50.04,26.8 46.99,23.5 48.39,20.07 57.15,27.43 54.99,26.04 65.53,38.61 65.02,33.15 62.1,33.53 62.1,29.84 65.28,28.57 67.56,29.59 69.72,44.7 67.56,27.43 73.79,26.92 63.12,22.86 74.93,10.16 67.31,10.16 67.31,2.54 74.93,2.54 11.43,19.56 2.54,34.29 75.18,65.28 74.93,72.39 67.31,72.39 59.69,72.39 30.99,52.07 34.29,54.61 33.4,52.07 38.1,43.18 34.29,43.18 36.32,45.72 2.54,2.54 7.62,2.54 12.7,2.54 17.78,2.54 22.86,2.54 27.94,2.54 33.02,2.54 6.35,16.51 2.54,46.99 5.08,57.15 2.54,68.58 5.08,63.5 7.62,67.31 8.89,72.39 13.97,72.39 73.91,53.59 1.91,7.62 25.15,10.67 34.29,16.51 34.29,14.1 34.29,11.81 27.18,19.05 30.48,19.05 34.29,19.05 38.1,19.05 40.01,16.51 64.77,19.05 64.77,16.51 60.96,16.51 14.22,46.1 11.18,47.75 14.99,41.15 14.99,29.72 18.67,27.43 20.32,33.02 20.32,25.4 18.03,20.32 4.32,23.37 51.18,16.64 46.61,16.51 49.53,10.92 43.94,2.54 62.74,11.43 45.72,10.92 43.94,6.86 66.17,49.28 59.44,36.58 51.31,30.23 50.42,39.5 54.23,39.37 54.86,33.53 60.33,40.89 16.26,66.17 17.14,70.99 16.64,55.75 44.45,70.87 41.91,70.87 47.88,66.67 30.99,48.51 34.29,59.69 37.47,59.69 34.54,67.69 30.48,67.56 35.81,72.01 30.48,71.75 34.29,24.38 37.47,24.38 31.11,24.38 66.8,53.09 71.5,39.5 67.94,39.24 11.94,61.72 11.43,34.67 24.38,17.65 61.47,25.53 71.12,53.59 53.98,26.04 49.28,27.94 71.12,38.73 68.45,38.35 66.8,45.21 66.04,48.26 66.67,41.15 60.58,43.69 60.71,39.88 59.18,55.88 53.85,62.74 38.61,67.18
  pour Bottom (isolate 0.406): 0,74.55 0,0 77.09,0 77.09,74.55
  pour Top (isolate 0.254): 0,74.55 0,0 77.09,0 77.09,74.55
HUM_DAT  (via drill 0.6)
  Top 0.254: U1.100 46.99,45.72 46.99,26.42 47.75,25.65 v49.02,25.65 | IC2.2 56.52,11.3 v56.64,11.43 58.17,12.95 R15.1
  Top 0.61: U1.64 U1.D2 U1.100
  Bottom 0.254: v49.02,25.65 49.66,25.02 60.58,25.02 61.72,23.88 61.72,19.3 56.64,14.22 v56.64,11.43
HUM_SCK  (via drill 0.6)
  Top 0.254: IC2.3 55.24,11.3 v55.12,11.43 55.63,11.94 R14.1 | v48.01,26.92 47.62,27.3 47.62,46.16 46.99,46.8 46.99,48.26 U1.99
  Top 0.61: U1.63 U1.D3 U1.99
  Bottom 0.254: v48.01,26.92 48.01,25.4 48.9,24.51 60.33,24.51 61.21,23.62 61.21,19.56 55.12,13.46 v55.12,11.43
I2C_SCL  (via drill 0.36 pad 0.79, 0.6, 0.6 pad 0.79)
  Top 0.152: U9.10 62.71,40.16 62.23,40.64 62.23,42.67 v64.26,44.7 65.02,45.47 65.02,50.8 64.75,51.08 U8.10
  Top 0.254: 57.47,24.77 55.31,26.92 52.83,26.92 49.53,30.23 49.53,42.93 v49.78,43.18 49.78,51.31 49.53,51.56 49.53,52.7 49.91,53.09 50.29,53.09 50.81,53.6 U4.P3 | R7.1 58.67,43.99 v58.67,42.93
  Top 0.305: JP14.2 58.42,21.59 58.42,23.81 57.47,24.77
  Top 0.406: U1.65 U1.D1 U1.101
  Bottom 0.254: 58.67,42.67 50.29,42.67 v49.78,43.18 46.99,43.18 U1.101 | 58.67,42.67 62.23,42.67 v64.26,44.7 | JP17.2 41.15,14.48 41.15,13.34 41.78,12.7 44.58,12.7 46.74,14.86 55.5,14.86 59.69,19.05 JP14.2 | v58.67,42.93 58.67,42.67
I2C_SDA  (via drill 0.6)
  Top 0.152: U8.9 64.77,51.56 65.41,50.93 65.41,44.07 v64.77,43.43 63.75,43.43 62.74,42.42 62.74,40.89 62.99,40.64 U9.9
  Top 0.254: 48.58,41.85 48.58,30.29 53.98,24.89 54.61,24.89 55.88,23.62 55.88,21.59 JP14.6 | 59.94,46.21 R6.1 59.82,46.24 59.82,42.42 59.18,41.78 v57.78,41.78 | U4.P2 50.16,53.71 50.04,53.59 49.47,53.59 48.77,52.9 48.77,51.31 49.15,50.93 49.15,43.81 48.9,43.56 48.9,42.16 48.58,41.85 | 48.58,41.85 v48.58,41.91
  Top 0.406: U1.66 U1.D0 U1.102
  Bottom 0.254: U1.102 v48.58,41.91 57.66,41.91 v57.78,41.78 57.91,41.78 58.17,41.91 63.25,41.91 v64.77,43.43 | JP14.6 54.61,18.29 51.82,15.49 46.23,15.49 44.7,13.97 JP17.1
LOWBAT  (via drill 0.6)
  Top 0.254: R9.1 v49.53,65.02 | U4.P1 48.87,54.51 48.51,54.86 v48.51,55.37
  Bottom 0.254: v49.53,65.02 49.53,56.39 v48.51,55.37
N$1
  Top 0.254: Q1.3 R5.2 30.11,8.62 U2.1
N$2
  Top 0.254: IC1.1 56.2,34.73 56.39,34.54 57.15,34.54
  Top 0.305: IC1.2 57.15,34.54 L1.2 57.05,31.48 | D1.C 52.07,33.38
  Top 0.406: 57.05,31.48 R1.2 53.96,31.5 52.83,31.5 52.07,32.26 52.07,33.38 | L1.2 59.94,31.38 C3.1
N$3
  Top 0.254: R9.2 49.53,71.09 49.51,71.09 49.51,71.32 LED2.C
N$5
  Top 0.254: 55.12,38.35 55.98,38.35 IC1.5
  Top 0.406: L2.1 52.07,38.35 | 52.07,38.35 D1.A | 52.07,38.35 55.12,38.35
N$7  (1 unrouted)
  Top 0.406: U1.56 U1.RST 46.23,67.31
N$8
  Top 0.406: U1.67 U1.C5 U1.103
N$9
  Top 0.254: U3.5 60.13,50.48 59.69,50.04 59.69,48.91 R11.2
N$11
  Top 0.254: LED1.C R8.1
N$12  (via drill 0.36 pad 0.79)
  Top 0.254: Q2.1 62.29,62.93 | 62.29,62.93 62.48,62.74 62.48,61.99 R10.1 | 62.29,62.93 62.29,63.56 v62.48,64.01
  Bottom 0.254: v62.48,64.01 62.48,69.6 63.5,70.61 SW1.1
N$15
  Top 0.406: U1.68 U1.C4 U1.104
N$16
  Top 0.254: U5.6 40.64,8.43 40.64,10.54 39.75,11.43 35.56,11.43 33.88,9.76 U2.3
  Top 0.406: 40.64,8.3 U5.6
N$20
  Top 0.406: U1.69 U1.C3 U1.105
N$22
  Top 0.406: U1.70 U1.C2 U1.106
N$23
  Top 0.406: U1.71 U1.C1 U1.107
N$24
  Top 0.406: U1.72 U1.C0 U1.108
N$26
  Top 0.406: U1.13 U1.B5 U1.49
N$27
  Top 0.406: U1.59 U1.D7 U1.95
N$28
  Top 0.406: U1.14 U1.B4 U1.50
N$29
  Top 0.406: U1.15 U1.B3 U1.51
N$30
  Top 0.406: U1.16 U1.B2 U1.52
N$31
  Top 0.406: U1.17 U1.B1 U1.53
N$32
  Top 0.406: U1.18 U1.B0 U1.54
N$33
  Top 0.406: D2.A 52.1,51.05 53.85,51.05 JP19.1 57.4,54.61 58.2,54.61 U3.3
PT+  (via drill 0.6)
  Top 0.152: P1.9 74.66,42.91 73.66,41.91 73.66,33.78 74.42,33.02 75.44,33.02 76.2,32.26 76.2,30.48 JP13.8
  Top 0.254: U9.6 63.88,42.16 65.28,42.16 66.42,43.31 69.47,43.31 v71.12,44.96
  Bottom 0.254: P1.9 73.71,43.94 72.14,43.94 v71.12,44.96
SN1A
  Top 0.152: JP13.6 74.17,31.75 72.9,33.02 71.88,33.02 70.99,33.91 70.99,34.29 70.36,34.92 70.36,42.11 70.33,42.14
  Top 0.254: P1.7 73.61,43.94 72.14,43.94 70.33,42.14 U9.5
SN1W
  Top 0.152: U9.4 69.09,41.66 69.85,40.89 69.85,34.67 70.48,34.04 70.48,33.66 JP13.5
  Top 0.254: P1.8 72.12,44.45 71.88,44.45 70.1,42.67 67.31,42.67 67.06,42.42 67.06,41.91 67.31,41.66 U9.4
SN2A  (1 unrouted)
  Top 0.254: P1.5 73.64,45.97 71.88,45.97 68.33,49.53 67.06,49.53 65.91,50.67 65.91,51.44 64.77,52.58 U8.7
  Bottom 0.152: 74.68,46.99 75.69,45.97 75.69,37.85 76.2,37.34 76.2,35.56 JP13.4
SN2W
  Top 0.254: U8.6 65.05,53.06 66.42,51.69 66.42,50.93 67.31,50.04 68.6,50.04 71.64,46.99 P1.6
  Bottom 0.152: JP13.3 73.66,35.56 73.66,40.39 72.64,41.4 71.37,41.4 68.83,43.94 68.83,45.21 70.61,46.99 P1.6
SN3A
  Top 0.152: P1.3 76.2,47.45 76.2,38.1 JP13.2
  Top 0.254: U8.5 69.62,53.06 71.12,51.56 71.12,51.05 72.14,50.04 73.61,50.04 P1.3
SN3W
  Top 0.254: U8.4 69.34,52.58 70.61,51.31 70.61,50.8 72.42,48.99 P1.4
  Bottom 0.152: P1.4 71.85,48.99 68.33,45.47 68.33,43.69 71.12,40.89 72.39,40.89 73.03,40.26 73.03,37.47 JP13.1
SPI_BAR_SS
  Top 0.152: R4.1 23.13,11.94 25.15,11.94 25.91,12.7 27.18,12.7 27.62,13.14 Q1.1
  Top 0.254: 27.67,13.85 Q1.1 | U1.12 21.59,40.64 21.59,12.45 22.08,11.95 R4.1
  Top 0.61: U1.12 U1.A0 U1.48
SPI_FREE_SS  (via drill 0.6)
  Top 0.254: JP9.2 7.62,52.07 9.53,52.07 v10.79,50.8 10.79,49.53 9.79,48.53 R2.1 | U1.60 v37.59,54.1
  Top 0.406: U1.60 U1.D6 U1.96
  Bottom 0.254: v37.59,54.1 34.29,50.8 v10.79,50.8
SPI_MISO  (via drill 0.6)
  Top 0.254: U6.7 17.29,67.3 17.78,66.8 | U5.8 38.01,8.38 36.07,8.38 34.04,6.35 v33.53,6.35
  Top 0.305: 17.78,66.8 v17.78,60.64
  Top 0.61: U1.8 U1.A4 U1.44
  Bottom 0.254: JP9.3 8.89,44.45 11.43,41.91 11.43,36.32 10.16,35.05 10.16,22.61 17.53,15.24 24.64,15.24 v33.53,6.35
  Bottom 0.305: U1.8 10.16,52.07 JP9.3 11.43,55.88 15.24,55.88 17.78,58.42 v17.78,60.64
SPI_MOSI  (via drill 0.6)
  Top 0.254: U1.7 23.32,54.61 | 23.32,54.61 24.13,54.61 | 23.32,54.63 23.32,54.61 | U6.3 12.88,65.91 10.16,63.18 | v17.78,40.01 17.78,43.43 18.41,44.07 v18.41,53.34
  Top 0.305: JP9.4 11.43,54.61 10.16,55.88 10.16,63.18
  Top 0.406: U5.7 39.28,10.07 v39.05,10.48
  Top 0.61: U1.7 U1.A5 U1.43
  Bottom 0.254: U1.7 21.59,53.34 v18.41,53.34 | v39.05,10.48 33.21,10.48 19.56,24.13 19.56,38.23 v17.78,40.01
  Bottom 0.305: U1.7 12.7,54.61 JP9.4
SPI_SCK  (via drill 0.6)
  Top 0.254: JP9.5 13.97,50.8 v15.24,49.53 | U6.5 15.09,65.89 13.97,64.77 | v36.58,5.08 38.1,3.56 38.1,3.08 U5.1
  Top 0.305: JP9.5 13.97,64.77
  Top 0.61: U1.9 U1.A3 U1.45
  Bottom 0.254: U1.9 v15.24,49.53 13.97,49.53 12.7,48.26 12.7,21.59 17.78,16.51 25.15,16.51 v36.58,5.08
SPI_SDC_SS  (via drill 0.6)
  Top 0.254: v14.61,48.26 10.16,52.7 10.16,54.61 9.4,55.37 9.4,60.71 8.06,62.04 | U6.2 11.79,65.76 11.75,65.72
  Top 0.305: R3.1 7.99,61.96 8.06,62.04 11.75,65.72
  Top 0.61: U1.46 U1.A2 U1.10
  Bottom 0.254: v14.61,48.26 21.59,48.26 U1.10
VIN_DCDC  (via drill 0.6)
  Top 0.152: 52.07,42.93 52.83,42.93 56.01,39.75 57.78,39.75 58.8,40.77 v58.93,40.77
  Top 0.254: R17.2 31.5,66.8 JP20.2 | U3.4 57.63,52.04 56.33,50.74 v55.44,50.74
  Top 0.305: v50.8,71.75 51.02,71.75 LED1.A
  Top 0.406: L2.2 52.07,42.93 52.07,44.73 C8.1 52.07,45.06 D2.C 53.63,47.02 54.86,48.26 54.86,50.04 55.31,50.48 v55.44,50.74
  Bottom 0.152: JP8.3 72.39,19.81 64.01,28.19 64.01,35.18 58.93,40.26 v58.93,40.77
  Bottom 0.406: v55.44,50.74 51.05,55.12 51.05,55.88 v50.8,71.75 40.26,71.75 39.12,70.61 39.12,69.34 37.85,68.07 36.32,68.07 JP20.2
VIN_MCU
  Bottom 0.406: U1.1 U1.VIN U1.37 JP20.1
VOC_AIN
  Top 0.152: JP13.7 71.63,28.45 66.29,28.45
  Top 0.254: U9.7 65.15,41.66 66.29,40.51 66.29,28.45 66.29,27.94 61.21,22.86 JP14.1
VOC_PIO  (via drill 0.6)
  Top 0.254: JP14.5 53.34,24.13 51.31,24.13 v50.04,22.86
  Top 0.406: U1.6 U1.DAC U1.42
  Bottom 0.254: 42.55,40.64 43.69,40.64 44.45,39.88 44.45,25.91 45.47,24.89 47.24,24.89 49.28,22.86 v50.04,22.86
  Bottom 0.305: U1.42 36.07,57.15 39.88,53.34 41.27,53.34 41.91,52.7 41.91,41.27 42.55,40.64
WKP
  Top 0.254: U1.5 20.95,57.78 20.95,42.93 20.32,42.29 20.32,36.32 16.51,32.51 JP18.2
  Top 0.406: U1.5 U1.WKP U1.41
(copper drawn outside any net)
  shapes: Top circle x2

### Text on the board
tPlace: SWTC | CLMP | RAW | RX | TX | G | V | 3V | 5V | MCU | G
tDocu: PH EL | VBAT-VIN | UCSD MetaSense / Board v2.3 | BLE / WKP | GND | 5V | SCL | SDA